# EAGLE schematic BMS Segment rev16 - Copy - Copy (EAGLE 9.6.2)
ENGINEER: Arvind Srinivasan
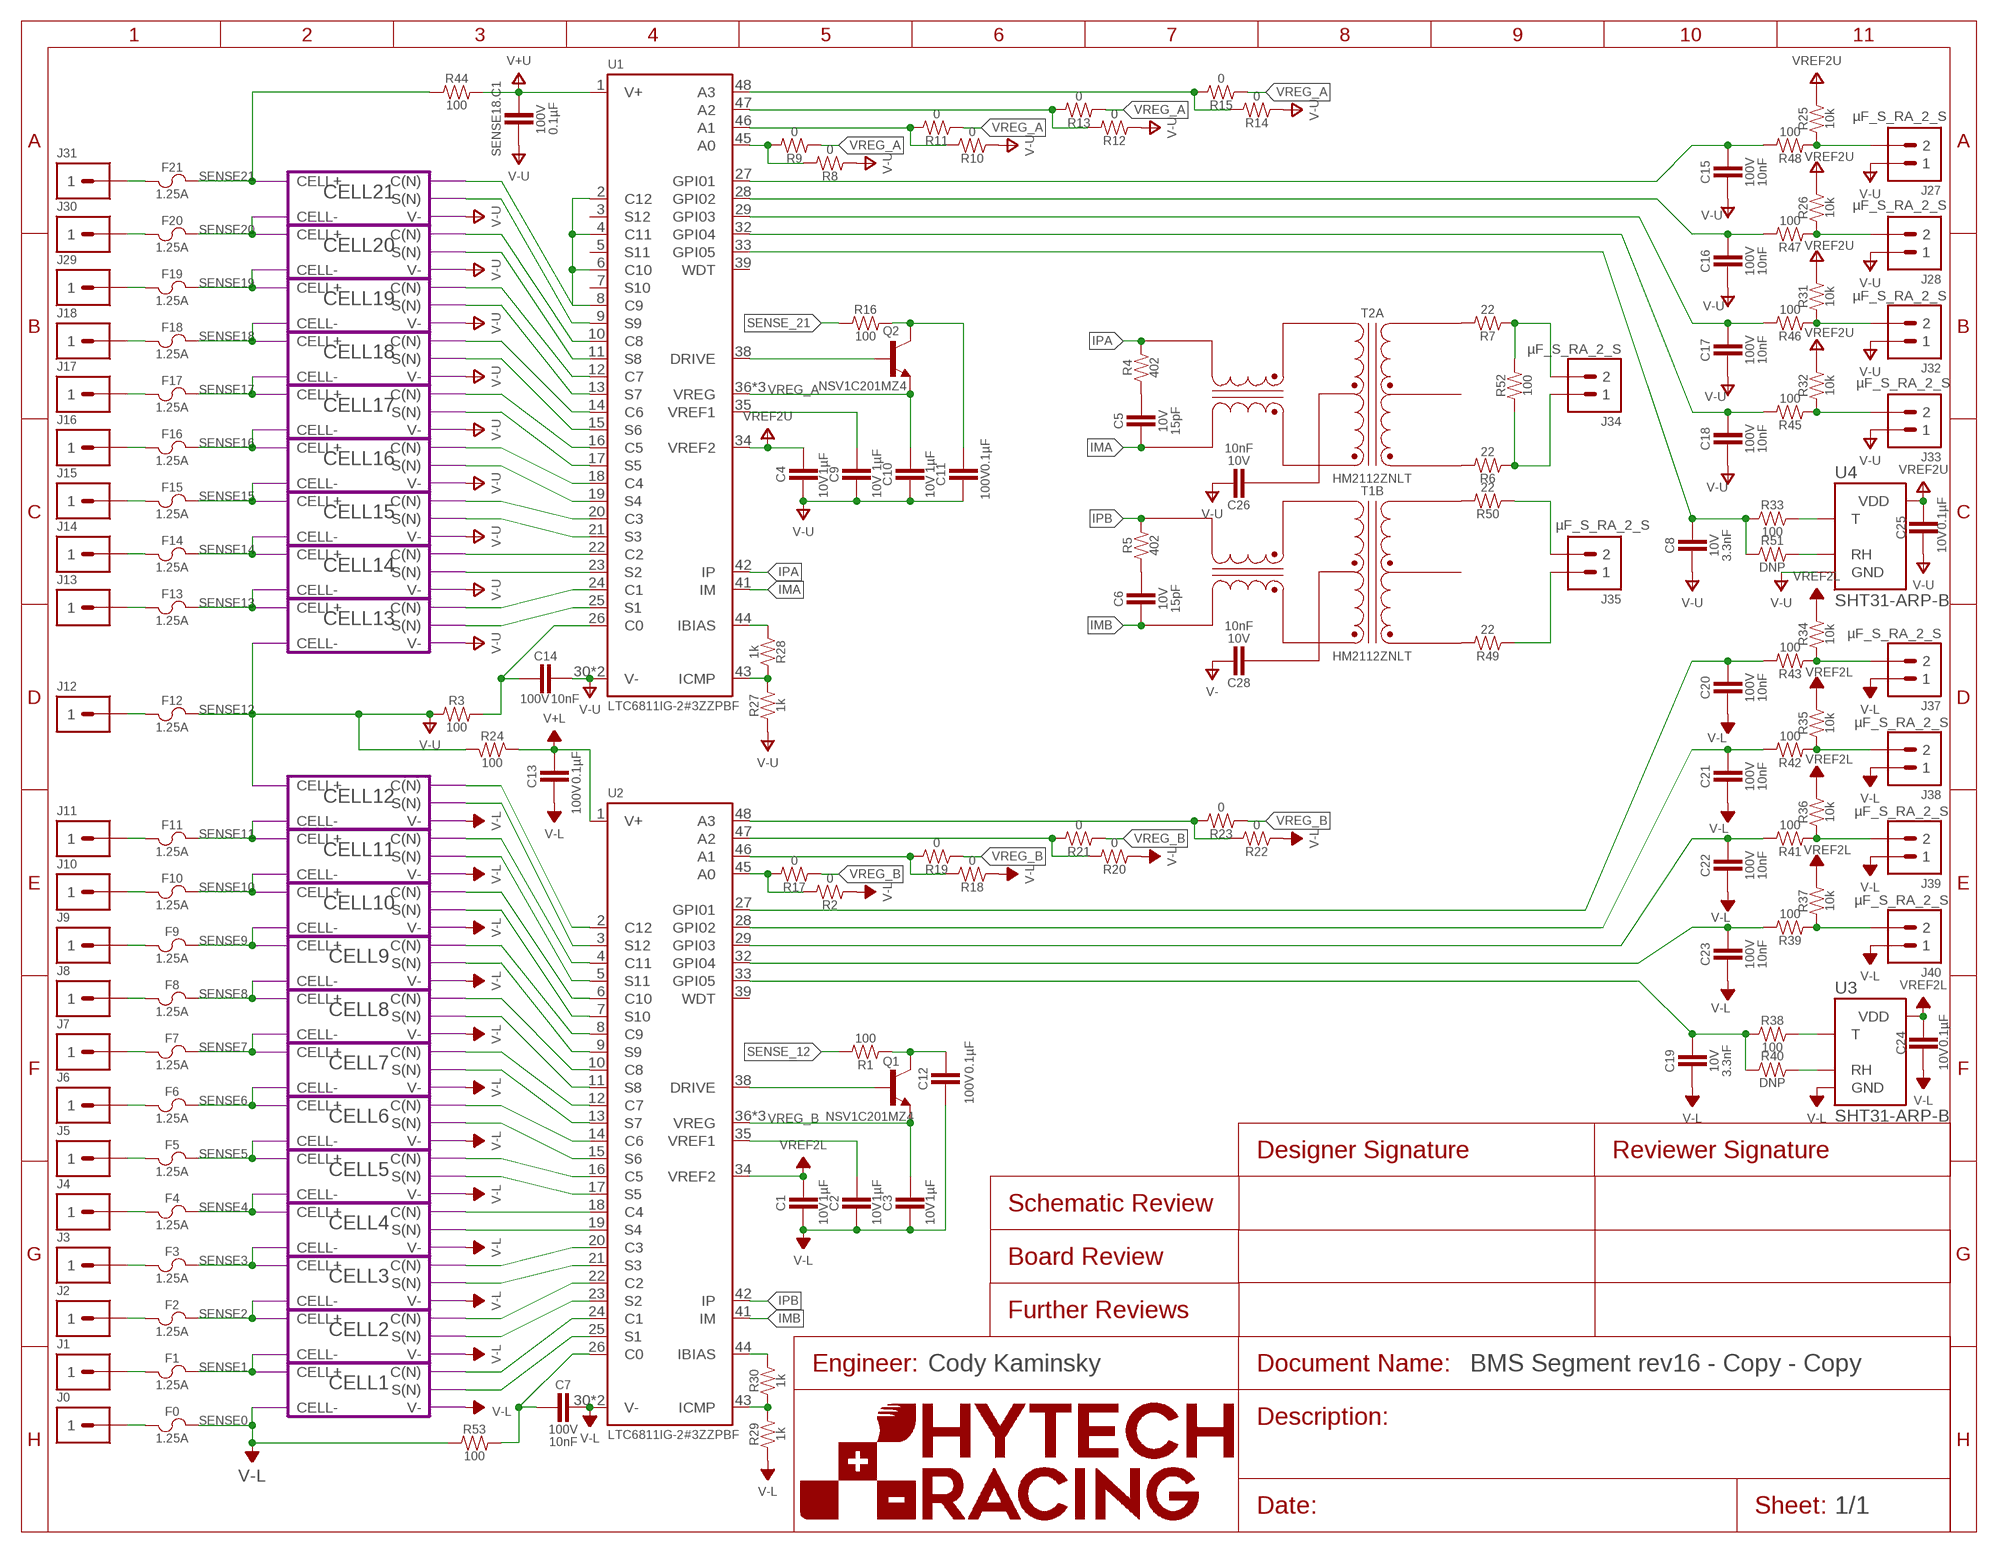
[diagram p0: schematic, sheet 1]
FRAME1 (FRAME): ENGINEER: Cody Kaminsky

## Parts
C1  CAPACITOR_0603_10V_1UF  [0603-CAP]
C2  CAPACITOR_0603_10V_1UF  [0603-CAP]
C3  CAPACITOR_0603_10V_1UF  [0603-CAP]
C4  CAPACITOR_0603_10V_1UF  [0603-CAP]
C5  CAPACITOR_0603_10V_15PF  [0603-CAP]
C6  CAPACITOR_0603_10V_15PF  [0603-CAP]
C7  CAPACITOR_0603_100V_10NF  [0603-CAP]
C8  CAPACITOR_0603_10V_3.3NF  [0603-CAP]
C9  CAPACITOR_0603_10V_1UF  [0603-CAP]
C10  CAPACITOR_0603_10V_1UF  [0603-CAP]
C11  CAPACITOR_0603_100V_0.1UF  [0603-CAP]
C12  CAPACITOR_0603_100V_0.1UF  [0603-CAP]
C13  CAPACITOR_0603_100V_0.1UF  [0603-CAP]
C14  CAPACITOR_0603_100V_10NF  [0603-CAP]
C15  CAPACITOR_0603_100V_10NF  [0603-CAP]
C16  CAPACITOR_0603_100V_10NF  [0603-CAP]
C17  CAPACITOR_0603_100V_10NF  [0603-CAP]
C18  CAPACITOR_0603_100V_10NF  [0603-CAP]
C19  CAPACITOR_0603_10V_3.3NF  [0603-CAP]
C20  CAPACITOR_0603_100V_10NF  [0603-CAP]
C21  CAPACITOR_0603_100V_10NF  [0603-CAP]
C22  CAPACITOR_0603_100V_10NF  [0603-CAP]
C23  CAPACITOR_0603_100V_10NF  [0603-CAP]
C24  CAPACITOR_0603_10V_0.1UF  [0603-CAP]
C25  CAPACITOR_0603_10V_0.1UF  [0603-CAP]
C26  CAPACITOR_0603_10V_10NF  [0603-CAP]
C28  CAPACITOR_0603_10V_10NF  [0603-CAP]
F0  FUSE0885  [0885]
F1  FUSE0885  [0885]
F2  FUSE0885  [0885]
F3  FUSE0885  [0885]
F4  FUSE0885  [0885]
F5  FUSE0885  [0885]
F6  FUSE0885  [0885]
F7  FUSE0885  [0885]
F8  FUSE0885  [0885]
F9  FUSE0885  [0885]
F10  FUSE0885  [0885]
F11  FUSE0885  [0885]
F12  FUSE0885  [0885]
F13  FUSE0885  [0885]
F14  FUSE0885  [0885]
F15  FUSE0885  [0885]
F16  FUSE0885  [0885]
F17  FUSE0885  [0885]
F18  FUSE0885  [0885]
F19  FUSE0885  [0885]
F20  FUSE0885  [0885]
F21  FUSE0885  [0885]
J0  CONNECTOR-1_5222_  [5222]
J1  CONNECTOR-1_5222_  [5222]
J2  CONNECTOR-1_5222_  [5222]
J3  CONNECTOR-1_5222_  [5222]
J4  CONNECTOR-1_5222_  [5222]
J5  CONNECTOR-1_5222_  [5222]
J6  CONNECTOR-1_5222_  [5222]
J7  CONNECTOR-1_5222_  [5222]
J8  CONNECTOR-1_5222_  [5222]
J9  CONNECTOR-1_5222_  [5222]
J10  CONNECTOR-1_5222_  [5222]
J11  CONNECTOR-1_5222_  [5222]
J12  CONNECTOR-1_5222_  [5222]
J13  CONNECTOR-1_5222_  [5222]
J14  CONNECTOR-1_5222_  [5222]
J15  CONNECTOR-1_5222_  [5222]
J16  CONNECTOR-1_5222_  [5222]
J17  CONNECTOR-1_5222_  [5222]
J18  CONNECTOR-1_5222_  [5222]
J27  CONNECTOR-2_MICROFIT_SMD_RIGHTANGLE_02_SINGLE_BLACK  [MOLEX_MICROFIT_SMD_RIGHTANGLE_02_SINGLE]
J28  CONNECTOR-2_MICROFIT_SMD_RIGHTANGLE_02_SINGLE_BLACK  [MOLEX_MICROFIT_SMD_RIGHTANGLE_02_SINGLE]
J29  CONNECTOR-1_5222_  [5222]
J30  CONNECTOR-1_5222_  [5222]
J31  CONNECTOR-1_5222_  [5222]
J32  CONNECTOR-2_MICROFIT_SMD_RIGHTANGLE_02_SINGLE_BLACK  [MOLEX_MICROFIT_SMD_RIGHTANGLE_02_SINGLE]
J33  CONNECTOR-2_MICROFIT_SMD_RIGHTANGLE_02_SINGLE_BLACK  [MOLEX_MICROFIT_SMD_RIGHTANGLE_02_SINGLE]
J34  CONNECTOR-2_MICROFIT_SMD_RIGHTANGLE_02_SINGLE_BLACK  [MOLEX_MICROFIT_SMD_RIGHTANGLE_02_SINGLE]
J35  CONNECTOR-2_MICROFIT_SMD_RIGHTANGLE_02_SINGLE_BLACK  [MOLEX_MICROFIT_SMD_RIGHTANGLE_02_SINGLE]
J37  CONNECTOR-2_MICROFIT_SMD_RIGHTANGLE_02_SINGLE_BLACK  [MOLEX_MICROFIT_SMD_RIGHTANGLE_02_SINGLE]
J38  CONNECTOR-2_MICROFIT_SMD_RIGHTANGLE_02_SINGLE_BLACK  [MOLEX_MICROFIT_SMD_RIGHTANGLE_02_SINGLE]
J39  CONNECTOR-2_MICROFIT_SMD_RIGHTANGLE_02_SINGLE_BLACK  [MOLEX_MICROFIT_SMD_RIGHTANGLE_02_SINGLE]
J40  CONNECTOR-2_MICROFIT_SMD_RIGHTANGLE_02_SINGLE_BLACK  [MOLEX_MICROFIT_SMD_RIGHTANGLE_02_SINGLE]
Q1  TRANSISTOR_NPN  [SOT223]
Q2  TRANSISTOR_NPN  [SOT223]
R1  RESISTOR_0603_100  [0603-RES]
R2  RESISTOR_0603_0  [0603-RES]
R3  RESISTOR_0603_100  [0603-RES]
R4  RESISTOR_0603_402  [0603-RES]
R5  RESISTOR_0603_402  [0603-RES]
R6  RESISTOR_0603_22  [0603-RES]
R7  RESISTOR_0603_22  [0603-RES]
R8  RESISTOR_0603_0  [0603-RES]
R9  RESISTOR_0603_0  [0603-RES]
R10  RESISTOR_0603_0  [0603-RES]
R11  RESISTOR_0603_0  [0603-RES]
R12  RESISTOR_0603_0  [0603-RES]
R13  RESISTOR_0603_0  [0603-RES]
R14  RESISTOR_0603_0  [0603-RES]
R15  RESISTOR_0603_0  [0603-RES]
R16  RESISTOR_0603_100  [0603-RES]
R17  RESISTOR_0603_0  [0603-RES]
R18  RESISTOR_0603_0  [0603-RES]
R19  RESISTOR_0603_0  [0603-RES]
R20  RESISTOR_0603_0  [0603-RES]
R21  RESISTOR_0603_0  [0603-RES]
R22  RESISTOR_0603_0  [0603-RES]
R23  RESISTOR_0603_0  [0603-RES]
R24  RESISTOR_0603_100  [0603-RES]
R25  RESISTOR_0603_10K  [0603-RES]
R26  RESISTOR_0603_10K  [0603-RES]
R27  RESISTOR_0603_1K  [0603-RES]
R28  RESISTOR_0603_1K  [0603-RES]
R29  RESISTOR_0603_1K  [0603-RES]
R30  RESISTOR_0603_1K  [0603-RES]
R31  RESISTOR_0603_10K  [0603-RES]
R32  RESISTOR_0603_10K  [0603-RES]
R33  RESISTOR_0603_100  [0603-RES]
R34  RESISTOR_0603_10K  [0603-RES]
R35  RESISTOR_0603_10K  [0603-RES]
R36  RESISTOR_0603_10K  [0603-RES]
R37  RESISTOR_0603_10K  [0603-RES]
R38  RESISTOR_0603_100  [0603-RES]
R39  RESISTOR_0603_100  [0603-RES]
R40  RESISTOR_0603_DNP  [0603-RES]
R41  RESISTOR_0603_100  [0603-RES]
R42  RESISTOR_0603_100  [0603-RES]
R43  RESISTOR_0603_100  [0603-RES]
R44  RESISTOR_0603_100  [0603-RES]
R45  RESISTOR_0603_100  [0603-RES]
R46  RESISTOR_0603_100  [0603-RES]
R47  RESISTOR_0603_100  [0603-RES]
R48  RESISTOR_0603_100  [0603-RES]
R49  RESISTOR_0603_22  [0603-RES]
R50  RESISTOR_0603_22  [0603-RES]
R51  RESISTOR_0603_DNP  [0603-RES]
R52  RESISTOR_0603_100  [0603-RES]
R53  RESISTOR_0603_100  [0603-RES]
SENSE18.C1  CAPACITOR_0603_100V_0.1UF  [0603-CAP]
T1  TRANSFORMER_HM2112ZNLT  [HM2112ZNLT]
T2  TRANSFORMER_HM2112ZNLT  [HM2112ZNLT]
U1  LTC6811-2  [SSOP-48]
U2  LTC6811-2  [SSOP-48]
U3  SHT31-ARP-B  [DFN-8]
U4  SHT31-ARP-B  [DFN-8]

## Module instances
CELL1 = CELL
CELL2 = CELL
CELL3 = CELL
CELL4 = CELL
CELL5 = CELL
CELL6 = CELL
CELL7 = CELL
CELL8 = CELL
CELL9 = CELL
CELL10 = CELL
CELL11 = CELL
CELL12 = CELL
CELL13 = CELL
CELL14 = CELL
CELL15 = CELL
CELL16 = CELL
CELL17 = CELL
CELL18 = CELL
CELL19 = CELL
CELL20 = CELL
CELL21 = CELL

## Nets
CC0: F0.1 J0.1
CC1: F1.1 J1.1
CC2: F2.1 J2.1
CC3: F3.1 J3.1
CC4: F4.1 J4.1
CC5: F5.1 J5.1
CC6: F6.1 J6.1
CC7: F7.1 J7.1
CC8: F8.1 J8.1
CC9: F9.1 J9.1
CC10: F10.1 J10.1
CC11: F11.1 J11.1
CC12: F12.1 J12.1
CC13: F13.1 J13.1
CC14: F14.1 J14.1
CC15: F15.1 J15.1
CC16: F16.1 J16.1
CC17: F17.1 J17.1
CC18: F18.1 J18.1
IMA: C5.2 T2.12(A:TD+) U1.41(IM)
IMB: C6.2 T1.9(B:TD+) U2.41(IM)
IPA: R4.2 T2.10(A:TD-) U1.42(IP)
IPB: R5.2 T1.7(B:TD-) U2.42(IP)
N$1: U1.2(C12) U1.4(C11) U1.6(C10) U1.8(C9) ; port CELL21.C(N)
N$2: U1.25(S1) ; port CELL13.S(N)
N$3: C20.1 R43.2 U2.27(GPI01)
N$4: C21.1 R42.2 U2.28(GPI02)
N$5: C22.1 R41.2 U2.29(GPI03)
N$6: U1.16(C5) ; port CELL17.C(N)
N$7: U1.22(C2) ; port CELL14.C(N)
N$8: U1.24(C1) ; port CELL13.C(N)
N$9: U1.9(S9) ; port CELL21.S(N)
N$10: U1.10(C8) ; port CELL20.C(N)
N$11: U1.11(S8) ; port CELL20.S(N)
N$12: R51.2 U4.1(RH)
N$13: U1.23(S2) ; port CELL14.S(N)
N$14: F21.1 J31.1
N$15: R8.2 R9.2 U1.45(A0)
N$16: U1.20(C3) ; port CELL15.C(N)
N$17: U1.17(S5) ; port CELL17.S(N)
N$19: U1.21(S3) ; port CELL15.S(N)
N$20: U1.12(C7) ; port CELL19.C(N)
N$21: J34.1 R6.1 R52.1
N$22: R49.2 T1.4(B:MX+)
N$23: F20.1 J30.1
N$24: F19.1 J29.1
N$25: R10.2 R11.2 U1.46(A1)
N$26: C23.1 R39.2 U2.32(GPI04)
N$28: J35.1 R49.1
N$29: R50.2 T1.6(B:MX-)
N$30: R33.2 U4.4(T)
N$31: U2.24(C1) ; port CELL1.C(N)
N$34: U1.13(S7) ; port CELL19.S(N)
N$41: U2.25(S1) ; port CELL1.S(N)
N$42: U2.12(C7) ; port CELL7.C(N)
N$43: U2.10(C8) ; port CELL8.C(N)
N$44: U2.8(C9) ; port CELL9.C(N)
N$45: U2.6(C10) ; port CELL10.C(N)
N$46: U2.4(C11) ; port CELL11.C(N)
N$47: U2.13(S7) ; port CELL7.S(N)
N$48: U2.11(S8) ; port CELL8.S(N)
N$49: U2.9(S9) ; port CELL9.S(N)
N$50: U2.7(S10) ; port CELL10.S(N)
N$51: U2.5(S11) ; port CELL11.S(N)
N$52: U2.2(C12) ; port CELL12.C(N)
N$53: U2.3(S12) ; port CELL12.S(N)
N$54: R12.2 R13.2 U1.47(A2)
N$55: R14.2 R15.2 U1.48(A3)
N$56: C9.1 U1.35(VREF1)
N$57: C12.1 Q1.2(COLLECTOR) Q1.4(COLLECTOR) R1.1
N$58: Q2.1(BASE) U1.38(DRIVE)
N$59: U1.18(C4) ; port CELL16.C(N)
N$60: U1.19(S4) ; port CELL16.S(N)
N$61: R27.2 R28.2 U1.43(ICMP)
N$62: C11.1 Q2.2(COLLECTOR) Q2.4(COLLECTOR) R16.2
N$63: Q1.1(BASE) U2.38(DRIVE)
N$64: C16.1 R47.2 U1.28(GPI02)
N$65: C2.1 U2.35(VREF1)
N$66: R2.2 R17.2 U2.45(A0)
N$67: R18.2 R19.2 U2.46(A1)
N$68: R20.2 R21.2 U2.47(A2)
N$69: R22.2 R23.2 U2.48(A3)
N$70: R28.1 U1.44(IBIAS)
N$71: J27.2 R25.1 R48.1
N$72: R29.2 R30.1 U2.43(ICMP)
N$73: R30.2 U2.44(IBIAS)
N$74: C15.1 R48.2 U1.27(GPI01)
N$75: C19.1 R38.1 R40.1 U2.33(GPI05)
N$76: J28.2 R26.1 R47.1
N$77: C17.1 R46.2 U1.29(GPI03)
N$78: J32.2 R31.1 R46.1
N$79: C18.1 R45.2 U1.32(GPI04)
N$80: J33.2 R32.1 R45.1
N$81: R40.2 U3.1(RH)
N$82: C8.1 R33.1 R51.1 U1.33(GPI05)
N$83: R38.2 U3.4(T)
N$84: J37.2 R34.1 R43.1
N$85: J35.2 R50.1
N$86: J38.2 R35.1 R42.1
N$87: U1.14(C6) ; port CELL18.C(N)
N$88: J39.2 R36.1 R41.1
N$89: C7.1 R53.2 U2.26(C0)
N$90: J40.2 R37.1 R39.1
N$91: C14.1 R3.2 U1.26(C0)
N$92: U1.15(S6) ; port CELL18.S(N)
N$93: R6.2 T2.1(A:MX+)
N$94: R7.2 T2.3(A:MX-)
N$95: J34.2 R7.1 R52.2
N$96: C28.2 T1.8(B:TCT)
N$97: C5.1 R4.1
N$98: C26.2 T2.11(A:TCT)
N$99: C6.1 R5.1
N$101: U2.14(C6) ; port CELL6.C(N)
N$102: U2.15(S6) ; port CELL6.S(N)
N$103: U2.16(C5) ; port CELL5.C(N)
N$104: U2.17(S5) ; port CELL5.S(N)
N$105: U2.18(C4) ; port CELL4.C(N)
N$106: U2.19(S4) ; port CELL4.S(N)
N$107: U2.20(C3) ; port CELL3.C(N)
N$108: U2.21(S3) ; port CELL3.S(N)
N$109: U2.22(C2) ; port CELL2.C(N)
N$110: U2.23(S2) ; port CELL2.S(N)
SENSE0: F0.2 R53.1 ; port CELL1.CELL- ; supply symbol labelled V-L
SENSE1: F1.2 ; port CELL1.CELL+ CELL2.CELL-
SENSE2: F2.2 ; port CELL2.CELL+ CELL3.CELL-
SENSE3: F3.2 ; port CELL3.CELL+ CELL4.CELL-
SENSE4: F4.2 ; port CELL4.CELL+ CELL5.CELL-
SENSE5: F5.2 ; port CELL5.CELL+ CELL6.CELL-
SENSE6: F6.2 ; port CELL6.CELL+ CELL7.CELL-
SENSE7: F7.2 ; port CELL7.CELL+ CELL8.CELL-
SENSE8: F8.2 ; port CELL8.CELL+ CELL9.CELL-
SENSE9: F9.2 ; port CELL9.CELL+ CELL10.CELL-
SENSE10: F10.2 ; port CELL10.CELL+ CELL11.CELL-
SENSE11: F11.2 ; port CELL11.CELL+ CELL12.CELL-
SENSE12: F12.2 R3.1 R24.2 ; port CELL13.CELL- CELL12.CELL+ ; supply symbol labelled V-U
SENSE13: F13.2 ; port CELL13.CELL+ CELL14.CELL-
SENSE14: F14.2 ; port CELL14.CELL+ CELL15.CELL-
SENSE15: F15.2 ; port CELL15.CELL+ CELL16.CELL-
SENSE16: F16.2 ; port CELL16.CELL+ CELL17.CELL-
SENSE17: F17.2 ; port CELL17.CELL+ CELL18.CELL-
SENSE18: F18.2 ; port CELL18.CELL+ CELL19.CELL-
SENSE19: F19.2 ; port CELL19.CELL+ CELL20.CELL-
SENSE20: F20.2 ; port CELL20.CELL+ CELL21.CELL-
SENSE21: F21.2 R44.1 ; port CELL21.CELL+
SENSE_12: R1.2
SENSE_21: R16.1
V+: R44.2 SENSE18.C1.1 U1.1(V+) ; supply symbol labelled V+U
V+B: C13.1 R24.1 U2.1(V+) ; supply symbol labelled V+L
V-: C1.2 C2.2 C3.2 C12.2 C13.2 C20.2 C21.2 C22.2 C23.2 C28.1 J37.1 J38.1 J39.1 J40.1 R2.1 R18.1 R20.1 R22.1 ; port CELL1.V- CELL2.V- CELL3.V- CELL4.V- CELL5.V- CELL6.V- CELL7.V- CELL8.V- CELL9.V- CELL10.V- CELL11.V- CELL12.V- ; supply symbol labelled V-L
V-_L: C7.2 R29.1 U2.30(V-) U2.31(V-) ; supply symbol labelled V-L
V-_U: C14.2 R27.1 U1.30(V-) U1.31(V-) ; supply symbol labelled V-U
V-B: C4.2 C9.2 C10.2 C11.2 C15.2 C16.2 C17.2 C18.2 C26.1 J27.1 J28.1 J32.1 J33.1 R8.1 R10.1 R12.1 R14.1 SENSE18.C1.2 ; port CELL21.V- CELL20.V- CELL18.V- CELL17.V- CELL16.V- CELL15.V- CELL14.V- CELL13.V- CELL19.V- ; supply symbol labelled V-U
V-L: C19.2 C24.2 U3.2(GND) U3.3(GND) U3.7(GND) U3.8(GND) U3.PAD(GND)
V-U: C8.2 C25.2 U4.2(GND) U4.3(GND) U4.7(GND) U4.8(GND) U4.PAD(GND)
VREF2: C4.1 R25.2 R26.2 R31.2 R32.2 U1.34(VREF2) ; supply symbol labelled VREF2U
VREF2B: C1.1 R34.2 R35.2 R36.2 R37.2 U2.34(VREF2) ; supply symbol labelled VREF2L
VREF2L: C24.1 U3.5(VDD)
VREF2U: C25.1 U4.5(VDD)
VREG_A: C10.1 Q2.3(EMITTER) R9.1 R11.1 R13.1 R15.1 U1.36(VREG) U1.37(VREG) U1.40(VREG)
VREG_B: C3.1 Q1.3(EMITTER) R17.1 R19.1 R21.1 R23.1 U2.36(VREG) U2.37(VREG) U2.40(VREG)
Unconnected: T1.1(A:MX+) T1.2(A:MCT) T1.3(A:MX-) T1.5(B:MCT) T1.10(A:TD-) T1.11(A:TCT) T1.12(A:TD+) T2.2(A:MCT) T2.4(B:MX+) T2.5(B:MCT) T2.6(B:MX-) T2.7(B:TD-) T2.8(B:TCT) T2.9(B:TD+) U1.3(S12) U1.5(S11) U1.7(S10) U1.39(WDT) U2.39(WDT)

## Library data of the parts
C1-C4 C9 C10 = HyTechDevices:CAPACITOR_?_*: Capacitor, Non-Polarized VJ...1BC Series Datasheet Samsung Datasheet Walsin Datasheet GRM188R61A226ME15D GRM188R61E106MA73D 885012006013 2220Y6300105KXTWS2 Yageo Class 2, X5R TDK C Series; CAPACITANCE: 1µF; DKPN: 311-1796-1-ND; MANUFACTURER: Yageo; MOPN: 603-CC603KRX7R6BB105; MPN: CC0603KRX7R6BB105; TOLERANCE: 10%; VOLTAGE: 10V
C5 C6 = HyTechDevices:CAPACITOR_?_*: Capacitor, Non-Polarized VJ...1BC Series Datasheet Samsung Datasheet Walsin Datasheet GRM188R61A226ME15D GRM188R61E106MA73D 885012006013 2220Y6300105KXTWS2 Yageo Class 2, X5R TDK C Series; CAPACITANCE: 15pF; DKPN: 720-VJ0603A150FXQPW1BCCT-ND; MANUFACTURER: Vishay Vitramon; MOPN: 77-VJ0603A150FXQPBC; MPN: VJ0603A150FXQPW1BC; TOLERANCE: 1%; VOLTAGE: 10V
C7 C14-C18 C20-C23 = HyTechDevices:CAPACITOR_?_*: Capacitor, Non-Polarized VJ...1BC Series Datasheet Samsung Datasheet Walsin Datasheet GRM188R61A226ME15D GRM188R61E106MA73D 885012006013 2220Y6300105KXTWS2 Yageo Class 2, X5R TDK C Series; CAPACITANCE: 10nF; DKPN: 311-1788-1-ND; MANUFACTURER: Yageo; MOPN: 603-CC603KRX7R0BB103; MPN: CC0603KRX7R0BB103; TOLERANCE: 10%; VOLTAGE: 100V
C8 C19 = HyTechDevices:CAPACITOR_?_*: Capacitor, Non-Polarized VJ...1BC Series Datasheet Samsung Datasheet Walsin Datasheet GRM188R61A226ME15D GRM188R61E106MA73D 885012006013 2220Y6300105KXTWS2 Yageo Class 2, X5R TDK C Series; CAPACITANCE: 3.3nF; DKPN: 732-7759-1-ND; MANUFACTURER: Würth Elektronik; MOPN: 710-885012006016; MPN: 885012006016; TOLERANCE: 5%; VOLTAGE: 10V
C11-C13 SENSE18.C1 = HyTechDevices:CAPACITOR_?_*: Capacitor, Non-Polarized VJ...1BC Series Datasheet Samsung Datasheet Walsin Datasheet GRM188R61A226ME15D GRM188R61E106MA73D 885012006013 2220Y6300105KXTWS2 Yageo Class 2, X5R TDK C Series; CAPACITANCE: 0.1µF; DKPN: 311-1523-1-ND; MANUFACTURER: Yageo; MOPN: 603-CC603KRX7R0BB104; MPN: CC0603KRX7R0BB104; TOLERANCE: 10%; VOLTAGE: 100V
C24 C25 = HyTechDevices:CAPACITOR_?_*: Capacitor, Non-Polarized VJ...1BC Series Datasheet Samsung Datasheet Walsin Datasheet GRM188R61A226ME15D GRM188R61E106MA73D 885012006013 2220Y6300105KXTWS2 Yageo Class 2, X5R TDK C Series; CAPACITANCE: 0.1µF; DKPN: 720-1688-1-ND; MANUFACTURER: Vishay Vitramon; MOPN: 77-VJ0603Y104JXQPBC; MPN: VJ0603Y104JXQPW1BC; TOLERANCE: 5%; VOLTAGE: 10V
C26 C28 = HyTechDevices:CAPACITOR_?_*: Capacitor, Non-Polarized VJ...1BC Series Datasheet Samsung Datasheet Walsin Datasheet GRM188R61A226ME15D GRM188R61E106MA73D 885012006013 2220Y6300105KXTWS2 Yageo Class 2, X5R TDK C Series; CAPACITANCE: 10nF; DKPN: 311-4054-1-ND; MANUFACTURER: Yageo; MOPN: 603-CC603KRX7R6BB103; MPN: CC0603KRX7R6BB103; TOLERANCE: 10%; VOLTAGE: 10V
F0 F1-F21 = HyTechDevices:FUSE: Ceramic Surface Mount Fuse Datasheet Fuse/Fuseclips Keystone Electronics 3568 Fuse Mouser Part Datasheet Bussman/Eaton Midget Fuse Clip 1A3400 Schurter 0751.0110 Brass Fuse Clip Datasheet Bel Fuse 0ZCF Series Surface Mount PTC (resettable) Fuse Datasheet Littelfuse 1812L Series Surface Mount PTC (resettable) Fuse Datasheet Ceramic SMD Surface Mount Fuse Datasheet; CURRENT: 1.25A; DKPN: F10986CT-ND; MANUFACTURER: Littelfuse Inc.; MOPN: 576-08851.25DR; MPN: 08851.25DR
J0 J1-J18 J29-J31 = HyTechDevices:CONNECTOR-1_?_*: 1 Pin Connector Pogo pin datasheet 5222 Spring datasheet; DKPN: 36-5222-ND; MANUFACTURER: Keystone Electronics; MODEL: SPRING; MOPN: 534-5222; MPN: 5222
J27 J28 J32-J35 J37-J40 = HyTechDevices:CONNECTOR-2_?_*: 2 Pin Connector; MANUFACTURER: Molex; MODEL: µF_S_RA_2_S; MPN: 436500214
Q1 Q2 = HyTechDevices:TRANSISTOR_NPN: NPN Transistor Datasheet MAX current: 2.0A MAX voltage: 100V; DKPN: NSV1C201MZ4T1GOSCT-ND; MANUFACTURER: ON Semiconductor; MOPN: 863-NSV1C201MZ4T1G; MPN: NSV1C201MZ4
R1 R3 R16 R24 R33 R38 R39 R41-R48 R52 R53 = HyTechDevices:RESISTOR_?_*: Resistor PWR163 Series AC Series PU Series ERA Series PWR263 Series RC Series ERJ Series; DKPN: 311-100HRCT-ND; MANUFACTURER: Yageo; MOPN: 603-RC0603FR-07100RL; MPN: RC0603FR-07100RL; POWER: 0.1W; RESISTANCE: 100; TOLERANCE: 1%; VOLTAGE_CONTINUOUS: 3.16V; VOLTAGE_MAX: 75V
R2 R8-R15 R17-R23 = HyTechDevices:RESISTOR_?_*: Resistor PWR163 Series AC Series PU Series ERA Series PWR263 Series RC Series ERJ Series; DKPN: 311-0.0HRCT-ND; MANUFACTURER: Yageo; MOPN: 603-RC0603FR-070RL; MPN: RC0603FR-070RL; POWER: 0.1W; RESISTANCE: 0; TOLERANCE: 1%; VOLTAGE_CONTINUOUS: 75V; VOLTAGE_MAX: 75V
R4 R5 = HyTechDevices:RESISTOR_?_*: Resistor PWR163 Series AC Series PU Series ERA Series PWR263 Series RC Series ERJ Series; DKPN: 311-402HRCT-ND; MANUFACTURER: Yageo; MOPN: 603-RC0603FR-07402RL; MPN: RC0603FR-07402RL; POWER: 0.1W; RESISTANCE: 402; TOLERANCE: 1%; VOLTAGE_CONTINUOUS: 6.34V; VOLTAGE_MAX: 75V
R6 R7 R49 R50 = HyTechDevices:RESISTOR_?_*: Resistor PWR163 Series AC Series PU Series ERA Series PWR263 Series RC Series ERJ Series; DKPN: 311-22.0HRCT-ND; MANUFACTURER: Yageo; MOPN: 603-RC0603FR-0722RL; MPN: RC0603FR-0722RL; POWER: 0.1W; RESISTANCE: 22; TOLERANCE: 1%; VOLTAGE_CONTINUOUS: 1.48V; VOLTAGE_MAX: 75V
R25 R26 R31 R32 R34-R37 = HyTechDevices:RESISTOR_?_*: Resistor PWR163 Series AC Series PU Series ERA Series PWR263 Series RC Series ERJ Series; DKPN: 311-10.0KHRCT-ND; MANUFACTURER: Yageo; MOPN: 603-RC0603FR-0710KL; MPN: RC0603FR-0710KL; POWER: 0.1W; RESISTANCE: 10k; TOLERANCE: 1%; VOLTAGE_CONTINUOUS: 31.62V; VOLTAGE_MAX: 75V
R27-R30 = HyTechDevices:RESISTOR_?_*: Resistor PWR163 Series AC Series PU Series ERA Series PWR263 Series RC Series ERJ Series; DKPN: 311-1.00KHRCT-ND; MANUFACTURER: Yageo; MOPN: 603-RC0603FR-071KL; MPN: RC0603FR-071KL; POWER: 0.1W; RESISTANCE: 1k; TOLERANCE: 1%; VOLTAGE_CONTINUOUS: 10.00V; VOLTAGE_MAX: 75V
R40 R51 = HyTechDevices:RESISTOR_?_*: Resistor PWR163 Series AC Series PU Series ERA Series PWR263 Series RC Series ERJ Series; RESISTANCE: DNP
T1 T2 = HyTechDevices:TRANSFORMER: 2 Channel SMT Transformer Specs for both HM2102NL and HM2112ZNL Transformers Turns ratio: 1CT: 1CT Isolation Voltage: 4300 VDC Inductance: 150 uH Leakage Inductance: 0.50 uH max HM2102NLT: DataSheet HM2112ZNLT: DataSheet; DKPN: 1840-1036-1-ND; MANUFACTURER: Pulse Electronics; MOPN: 673-HM2112ZNLT; MPN: HM2112ZNLT
U1 U2 = HyTechDevices:LTC6811-2: Linear Technology Multicell Battery Stack Monitor Variant 2: Addressable/Multi-Drop Configuration Datasheet; DKPN: LTC6811IG-2#3ZZPBF-ND; MANUFACTURER: Analog Devices Inc.; MOPN: 584-6811IG-2#3ZZPB; MPN: LTC6811IG-2#3ZZPBF
U3 U4 = HyTechDevices:SHT3*-ARP-B: Humidity and Temperature Sensor Datasheet; DKPN: 1649-1012-1-ND; MANUFACTUER: Sensirion AG; MOPN: 403-SHT31-ARP-B; MPN: SHT31-ARP-B

## Module CELL
Ports: CELL+(in) S(N)(in) C(N)(out) CELL-(out) V-(pwr)
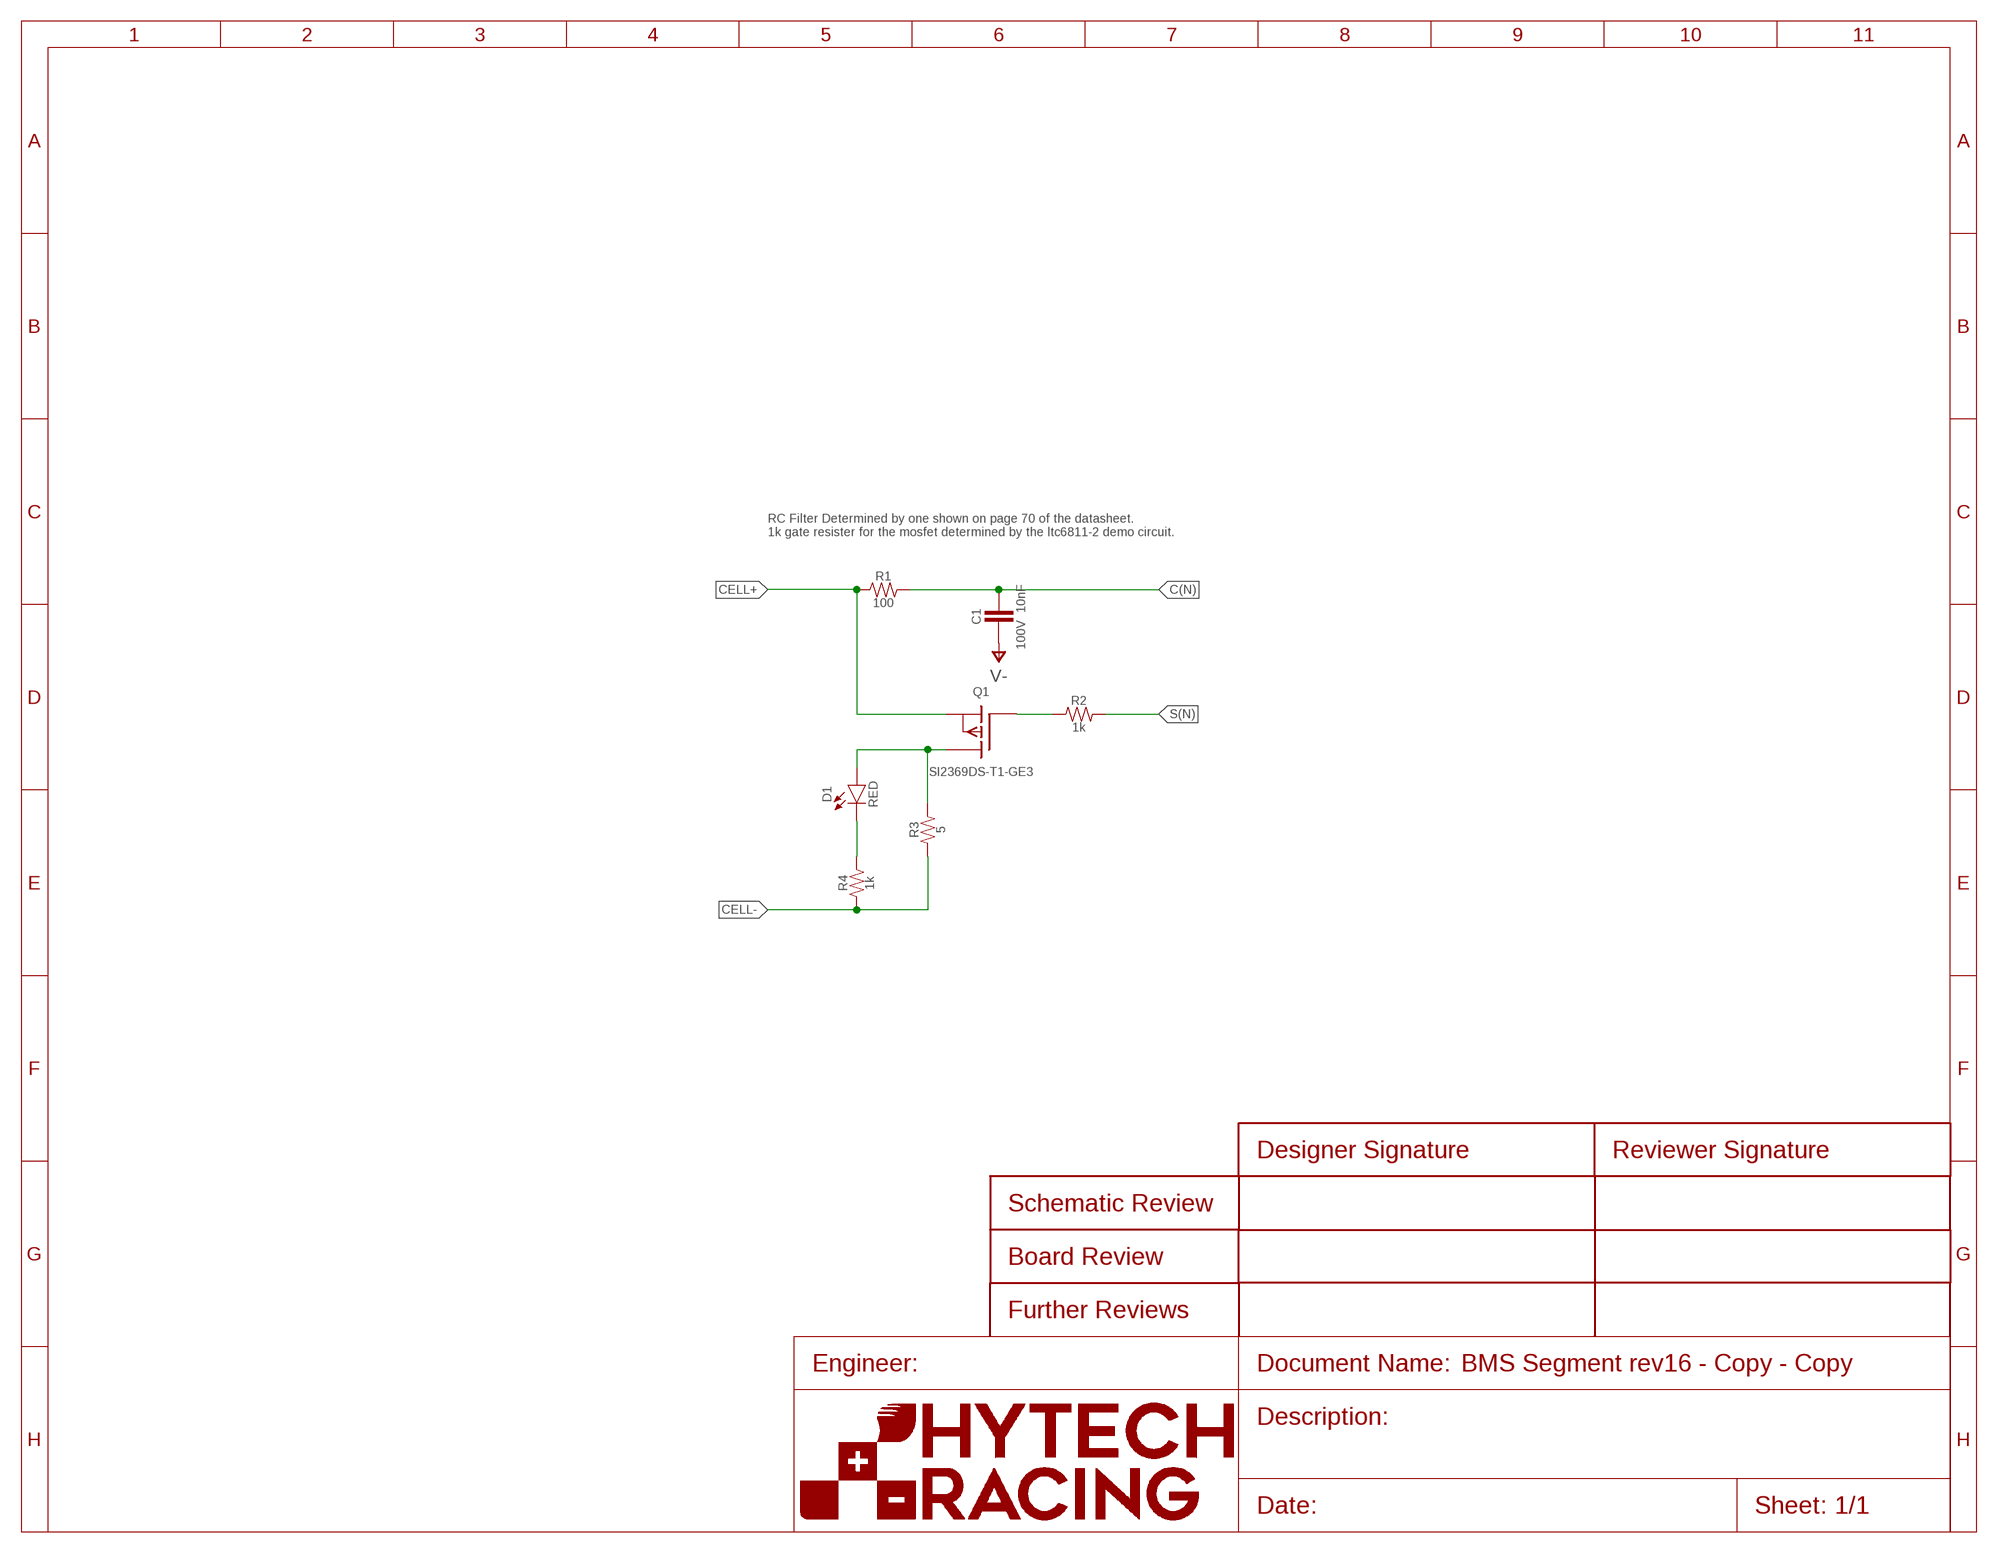
[diagram p1: schematic, module CELL, sheet 1]
U$1 (FRAME_A): FRAME_DESCRIPTION: Default; ORIENTATION: LANDSCAPE; SIZE: A

### Parts
C1  CAPACITOR_0603_100V_10NF  [0603-CAP]
D1  LED_0603_RED  [0603-LED]
Q1  TRANSISTOR_P_MOS_SOT23_SI2369DS-T1-GE3  [SOT-23]
R1  RESISTOR_0603_100  [0603-RES]
R2  RESISTOR_0603_1K  [0603-RES]
R3  RESISTOR_PWR263_5  [PWR263]
R4  RESISTOR_0603_1K  [0603-RES]

### Nets
C(N): C1.1 R1.2
CELL+: Q1.2(S) R1.1
CELL-: R3.1 R4.1
N$5: Q1.1(G) R2.1
N$6: D1.2(A) Q1.3(D) R3.2
N$7: D1.1(C) R4.2
S(N): R2.2
V-: C1.2

### Notes on the sheet
- RC Filter Determined by one shown on page 70 of the datasheet.
  1k gate resister for the mosfet determined by the ltc6811-2 demo circuit.

### Library data of the parts
C1 = HyTechDevices:CAPACITOR_?_*: Capacitor, Non-Polarized VJ...1BC Series Datasheet Samsung Datasheet Walsin Datasheet GRM188R61A226ME15D GRM188R61E106MA73D 885012006013 2220Y6300105KXTWS2 Yageo Class 2, X5R TDK C Series; CAPACITANCE: 10nF; DKPN: 311-1788-1-ND; MANUFACTURER: Yageo; MOPN: 603-CC603KRX7R0BB103; MPN: CC0603KRX7R0BB103; TOLERANCE: 10%; VOLTAGE: 100V
D1 = HyTechDevices:LED_?_*: LED; COLOR: RED; DKPN: 754-1786-1-ND; MANUFACTURER: Kingbright; MOPN: 604-APT1608SECKJ3PRV; MPN: APT1608SECK/J3-PRV
Q1 = HyTechDevices:TRANSISTOR_P_MOS_?_*: MOSFET P Channel Datasheet; DKPN: SI2369DS-T1-GE3CT-ND; MANUFACTURER: Vishay Siliconix; MOPN: 78-SI2369DS-T1-GE3; MPN: SI2369DS-T1-GE3
R1 = HyTechDevices:RESISTOR_?_*: Resistor PWR163 Series AC Series PU Series ERA Series PWR263 Series RC Series ERJ Series; DKPN: 311-100HRCT-ND; MANUFACTURER: Yageo; MOPN: 603-RC0603FR-07100RL; MPN: RC0603FR-07100RL; POWER: 0.1W; RESISTANCE: 100; TOLERANCE: 1%; VOLTAGE_CONTINUOUS: 3.16V; VOLTAGE_MAX: 75V
R2 R4 = HyTechDevices:RESISTOR_?_*: Resistor PWR163 Series AC Series PU Series ERA Series PWR263 Series RC Series ERJ Series; DKPN: 311-1.00KHRCT-ND; MANUFACTURER: Yageo; MOPN: 603-RC0603FR-071KL; MPN: RC0603FR-071KL; POWER: 0.1W; RESISTANCE: 1k; TOLERANCE: 1%; VOLTAGE_CONTINUOUS: 10.00V; VOLTAGE_MAX: 75V
R3 = HyTechDevices:RESISTOR_?_*: Resistor PWR163 Series AC Series PU Series ERA Series PWR263 Series RC Series ERJ Series; DKPN: PWR263S-35-5R00F-ND; MANUFACTURER: Bourns Inc.; MOPN: 652-PWR263S355R00F; MPN: PWR263S-35-5R00F; POWER: 3.5W; RESISTANCE: 5; TOLERANCE: 1%; VOLTAGE_CONTINUOUS: 4.183V; VOLTAGE_MAX: 4.183V

## Module THERM
Ports: GPIO(out) V-(pwr) VREF2(pwr) THERM(io)
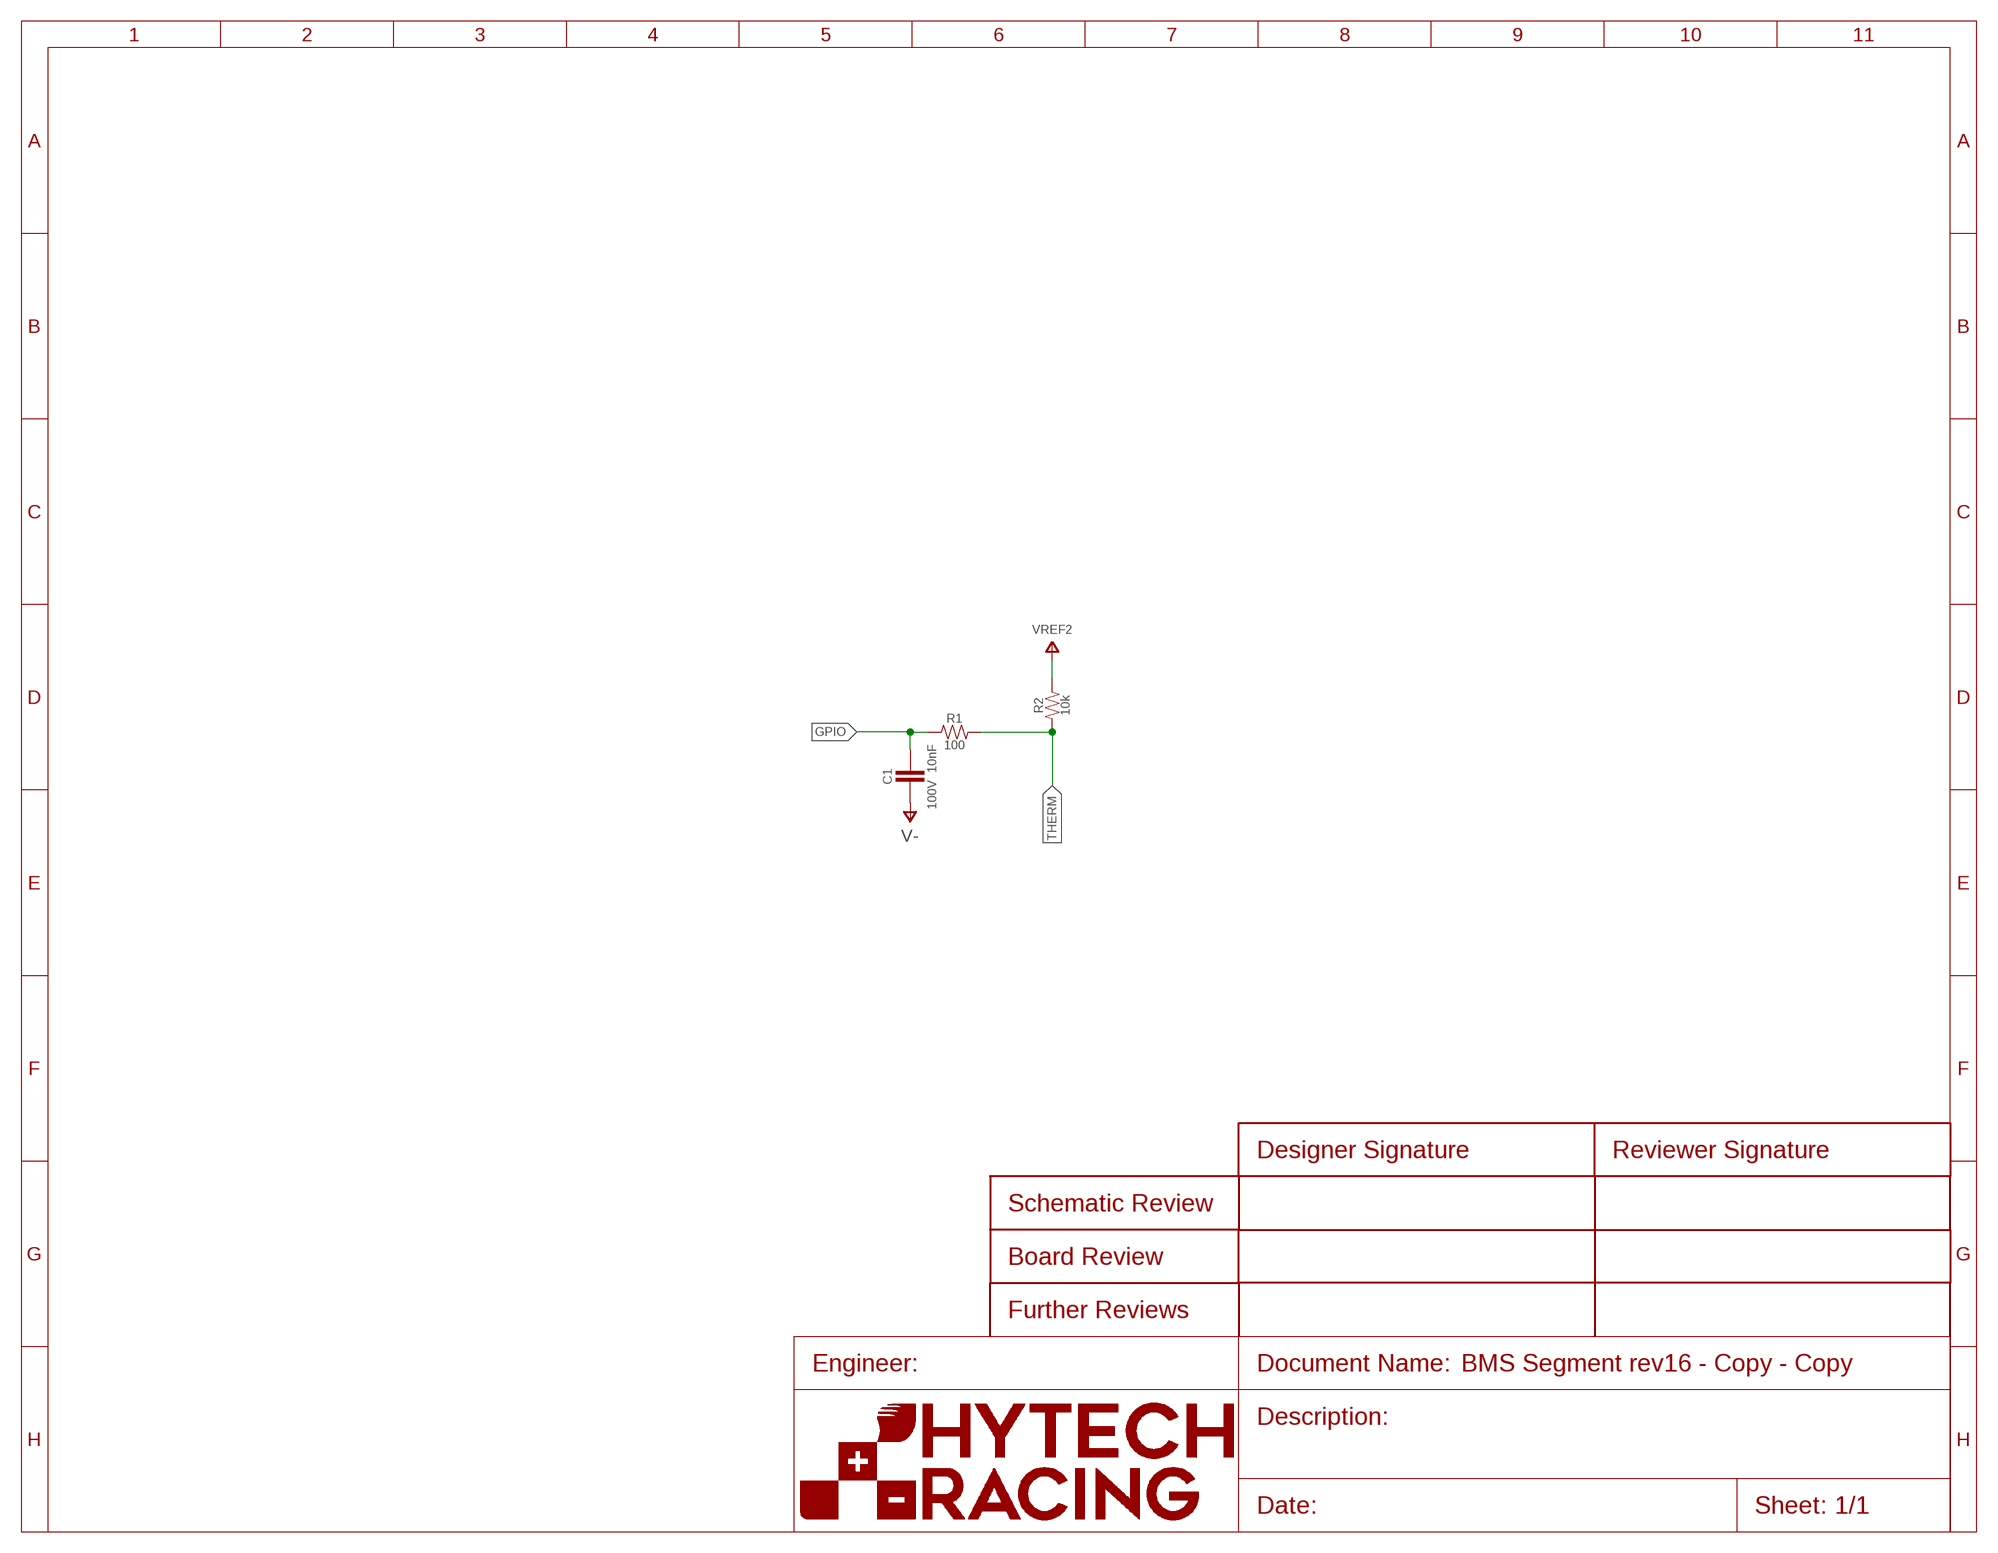
[diagram p2: schematic, module THERM, sheet 1]
U$1 (FRAME_A): FRAME_DESCRIPTION: Default; ORIENTATION: LANDSCAPE; SIZE: A

### Parts
C1  CAPACITOR_0603_100V_10NF  [0603-CAP]
R1  RESISTOR_0603_100  [0603-RES]
R2  RESISTOR_0603_10K  [0603-RES]

### Nets
GPIO: C1.1 R1.1
THERM: R1.2 R2.1
V-: C1.2
VREF2: R2.2

### Library data of the parts
C1 = HyTechDevices:CAPACITOR_?_*: Capacitor, Non-Polarized VJ...1BC Series Datasheet Samsung Datasheet Walsin Datasheet GRM188R61A226ME15D GRM188R61E106MA73D 885012006013 2220Y6300105KXTWS2 Yageo Class 2, X5R TDK C Series; CAPACITANCE: 10nF; DKPN: 311-1788-1-ND; MANUFACTURER: Yageo; MOPN: 603-CC603KRX7R0BB103; MPN: CC0603KRX7R0BB103; TOLERANCE: 10%; VOLTAGE: 100V
R1 = HyTechDevices:RESISTOR_?_*: Resistor PWR163 Series AC Series PU Series ERA Series PWR263 Series RC Series ERJ Series; DKPN: 311-100HRCT-ND; MANUFACTURER: Yageo; MOPN: 603-RC0603FR-07100RL; MPN: RC0603FR-07100RL; POWER: 0.1W; RESISTANCE: 100; TOLERANCE: 1%; VOLTAGE_CONTINUOUS: 3.16V; VOLTAGE_MAX: 75V
R2 = HyTechDevices:RESISTOR_?_*: Resistor PWR163 Series AC Series PU Series ERA Series PWR263 Series RC Series ERJ Series; DKPN: 311-10.0KHRCT-ND; MANUFACTURER: Yageo; MOPN: 603-RC0603FR-0710KL; MPN: RC0603FR-0710KL; POWER: 0.1W; RESISTANCE: 10k; TOLERANCE: 1%; VOLTAGE_CONTINUOUS: 31.62V; VOLTAGE_MAX: 75V

## Net classes
1 unfused_hv: clearance 0.025 mm to class 0, clearance 3.2 mm